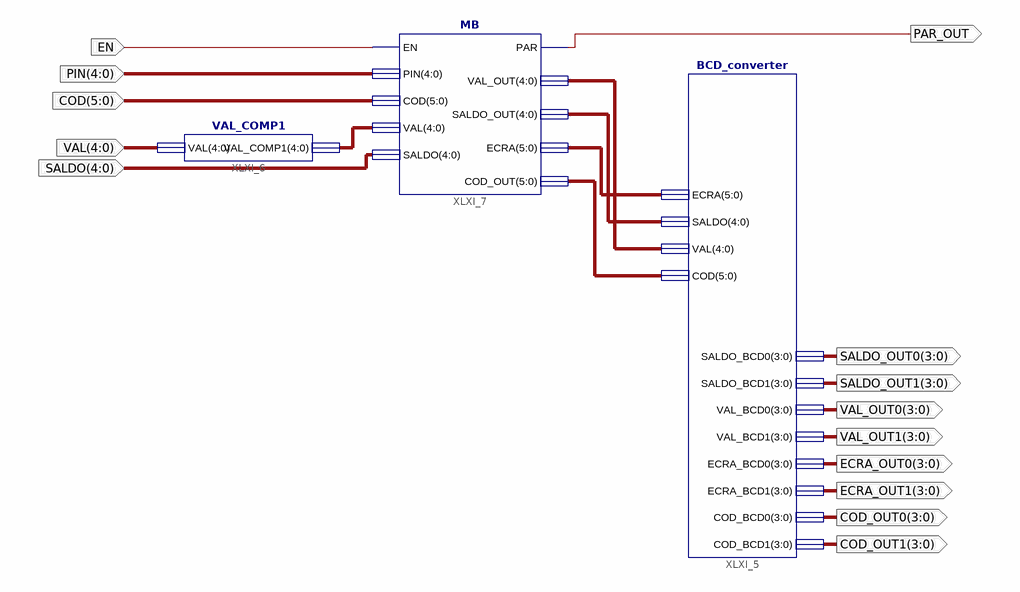
[diagram p0: schematic sheet 1]
// Xilinx ISE schematic MB_Schematica.sch (artix7) as structural Verilog: 3 symbols, 14 ports
module MB_Schematica (
  input  EN,
  input  [4:0] PIN,
  input  [5:0] COD,
  input  [4:0] SALDO,
  input  [4:0] VAL,
  output PAR_OUT,
  output [3:0] SALDO_OUT0,
  output [3:0] SALDO_OUT1,
  output [3:0] VAL_OUT0,
  output [3:0] VAL_OUT1,
  output [3:0] ECRA_OUT0,
  output [3:0] ECRA_OUT1,
  output [3:0] COD_OUT0,
  output [3:0] COD_OUT1
);

  wire [4:0] XLXN_76, XLXN_77, XLXN_84;
  wire [5:0] XLXN_78, XLXN_79;

  BCD_converter XLXI_5 (
    .ECRA(XLXN_78), .SALDO(XLXN_77), .VAL(XLXN_76), .COD(XLXN_79), .SALDO_BCD0(SALDO_OUT0),
    .SALDO_BCD1(SALDO_OUT1), .VAL_BCD0(VAL_OUT0), .VAL_BCD1(VAL_OUT1), .ECRA_BCD0(ECRA_OUT0),
    .ECRA_BCD1(ECRA_OUT1), .COD_BCD0(COD_OUT0), .COD_BCD1(COD_OUT1));
  VAL_COMP1 XLXI_6 (.VAL(VAL), .VAL_COMP1(XLXN_84));
  MB XLXI_7 (
    .EN(EN), .PIN(PIN), .COD(COD), .VAL(XLXN_84), .SALDO(SALDO), .PAR(PAR_OUT), .COD_OUT(XLXN_79),
    .VAL_OUT(XLXN_76), .SALDO_OUT(XLXN_77), .ECRA(XLXN_78));
endmodule
